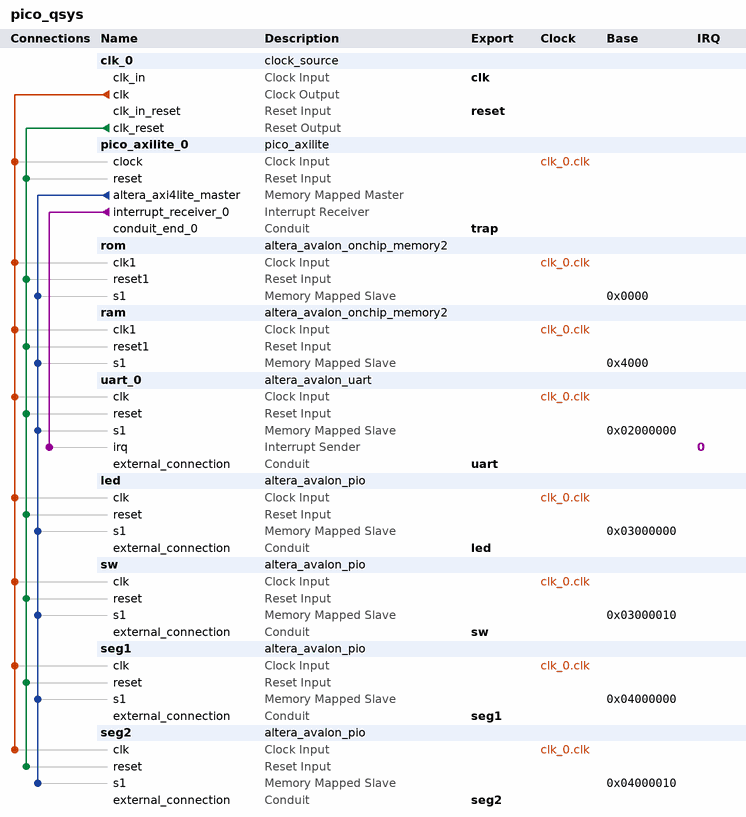
[diagram p0: system contents]
# Platform Designer (Qsys) system pico_qsys, MAX 10 10M08SAM153I7G
# Parameters at their usual value, and those the tool derives, are not listed.
package require -exact qsys 18.1
create_system pico_qsys
set_project_property DEVICE_FAMILY {MAX 10}
set_project_property DEVICE 10M08SAM153I7G

add_instance clk_0 clock_source 18.1
set_instance_parameter_value clk_0 clockFrequency 50000000

add_instance pico_axilite_0 pico_axilite 1.0
set_instance_parameter_value pico_axilite_0 BARREL_SHIFTER 0
set_instance_parameter_value pico_axilite_0 CATCH_ILLINSN 1
set_instance_parameter_value pico_axilite_0 CATCH_MISALIGN 1
set_instance_parameter_value pico_axilite_0 COMPRESSED_ISA 0
set_instance_parameter_value pico_axilite_0 ENABLE_COUNTERS 1
set_instance_parameter_value pico_axilite_0 ENABLE_COUNTERS64 1
set_instance_parameter_value pico_axilite_0 ENABLE_DIV 1
set_instance_parameter_value pico_axilite_0 ENABLE_FAST_MUL 0
set_instance_parameter_value pico_axilite_0 ENABLE_IRQ 1
set_instance_parameter_value pico_axilite_0 ENABLE_IRQ_QREGS 1
set_instance_parameter_value pico_axilite_0 ENABLE_IRQ_TIMER 1
set_instance_parameter_value pico_axilite_0 ENABLE_MUL 1
set_instance_parameter_value pico_axilite_0 ENABLE_PCPI 1
set_instance_parameter_value pico_axilite_0 ENABLE_REGS_16_31 1
set_instance_parameter_value pico_axilite_0 ENABLE_REGS_DUALPORT 1
set_instance_parameter_value pico_axilite_0 ENABLE_TRACE 0
set_instance_parameter_value pico_axilite_0 LATCHED_IRQ 4294967295
set_instance_parameter_value pico_axilite_0 MASKED_IRQ 0
set_instance_parameter_value pico_axilite_0 PROGADDR_IRQ 16
set_instance_parameter_value pico_axilite_0 PROGADDR_RESET 0
set_instance_parameter_value pico_axilite_0 REGS_INIT_ZERO 0
set_instance_parameter_value pico_axilite_0 STACKADDR 4294967295
set_instance_parameter_value pico_axilite_0 TWO_CYCLE_ALU 0
set_instance_parameter_value pico_axilite_0 TWO_CYCLE_COMPARE 0
set_instance_parameter_value pico_axilite_0 TWO_STAGE_SHIFT 1

add_instance rom altera_avalon_onchip_memory2 18.1
set_instance_parameter_value rom dataWidth 32
set_instance_parameter_value rom dualPort false
set_instance_parameter_value rom initMemContent true
set_instance_parameter_value rom initializationFileName C:/Users/91947/Desktop/final/soc_axilite/hx8kdemo_fw.hex
set_instance_parameter_value rom memorySize 16384
set_instance_parameter_value rom useNonDefaultInitFile true
set_instance_parameter_value rom writable false

add_instance ram altera_avalon_onchip_memory2 18.1
set_instance_parameter_value ram dataWidth 32
set_instance_parameter_value ram dualPort false
set_instance_parameter_value ram initMemContent true
set_instance_parameter_value ram initializationFileName onchip_mem.hex
set_instance_parameter_value ram memorySize 16384

add_instance uart_0 altera_avalon_uart 18.1
set_instance_parameter_value uart_0 baud 115200
set_instance_parameter_value uart_0 dataBits 8
set_instance_parameter_value uart_0 fixedBaud false
set_instance_parameter_value uart_0 parity NONE
set_instance_parameter_value uart_0 stopBits 1

add_instance led altera_avalon_pio 18.1
set_instance_parameter_value led direction Output
set_instance_parameter_value led resetValue 255
set_instance_parameter_value led width 8

add_instance sw altera_avalon_pio 18.1
set_instance_parameter_value sw direction Input
set_instance_parameter_value sw width 8

add_instance seg1 altera_avalon_pio 18.1
set_instance_parameter_value seg1 direction Output
set_instance_parameter_value seg1 resetValue 63
set_instance_parameter_value seg1 width 8

add_instance seg2 altera_avalon_pio 18.1
set_instance_parameter_value seg2 direction Output
set_instance_parameter_value seg2 resetValue 63
set_instance_parameter_value seg2 width 8

# connections
add_connection clk_0.clk led.clk clock
add_connection clk_0.clk pico_axilite_0.clock clock
add_connection clk_0.clk ram.clk1 clock
add_connection clk_0.clk rom.clk1 clock
add_connection clk_0.clk seg1.clk clock
add_connection clk_0.clk seg2.clk clock
add_connection clk_0.clk sw.clk clock
add_connection clk_0.clk uart_0.clk clock
add_connection clk_0.clk_reset led.reset reset
add_connection clk_0.clk_reset pico_axilite_0.reset reset
add_connection clk_0.clk_reset ram.reset1 reset
add_connection clk_0.clk_reset rom.reset1 reset
add_connection clk_0.clk_reset seg1.reset reset
add_connection clk_0.clk_reset seg2.reset reset
add_connection clk_0.clk_reset sw.reset reset
add_connection clk_0.clk_reset uart_0.reset reset
add_connection pico_axilite_0.altera_axi4lite_master led.s1 avalon
set_connection_parameter_value pico_axilite_0.altera_axi4lite_master/led.s1 baseAddress 0x03000000
add_connection pico_axilite_0.altera_axi4lite_master ram.s1 avalon
set_connection_parameter_value pico_axilite_0.altera_axi4lite_master/ram.s1 baseAddress 0x4000
add_connection pico_axilite_0.altera_axi4lite_master rom.s1 avalon
set_connection_parameter_value pico_axilite_0.altera_axi4lite_master/rom.s1 baseAddress 0x0000
add_connection pico_axilite_0.altera_axi4lite_master seg1.s1 avalon
set_connection_parameter_value pico_axilite_0.altera_axi4lite_master/seg1.s1 baseAddress 0x04000000
add_connection pico_axilite_0.altera_axi4lite_master seg2.s1 avalon
set_connection_parameter_value pico_axilite_0.altera_axi4lite_master/seg2.s1 baseAddress 0x04000010
add_connection pico_axilite_0.altera_axi4lite_master sw.s1 avalon
set_connection_parameter_value pico_axilite_0.altera_axi4lite_master/sw.s1 baseAddress 0x03000010
add_connection pico_axilite_0.altera_axi4lite_master uart_0.s1 avalon
set_connection_parameter_value pico_axilite_0.altera_axi4lite_master/uart_0.s1 baseAddress 0x02000000
add_connection pico_axilite_0.interrupt_receiver_0 uart_0.irq interrupt
set_connection_parameter_value pico_axilite_0.interrupt_receiver_0/uart_0.irq irqNumber 0

# exported interfaces
add_interface clk clock sink
set_interface_property clk EXPORT_OF clk_0.clk_in
add_interface led conduit end
set_interface_property led EXPORT_OF led.external_connection
add_interface reset reset sink
set_interface_property reset EXPORT_OF clk_0.clk_in_reset
add_interface seg1 conduit end
set_interface_property seg1 EXPORT_OF seg1.external_connection
add_interface seg2 conduit end
set_interface_property seg2 EXPORT_OF seg2.external_connection
add_interface sw conduit end
set_interface_property sw EXPORT_OF sw.external_connection
add_interface trap conduit end
set_interface_property trap EXPORT_OF pico_axilite_0.conduit_end_0
add_interface uart conduit end
set_interface_property uart EXPORT_OF uart_0.external_connection

set_interconnect_requirement {$system} qsys_mm.clockCrossingAdapter HANDSHAKE
set_interconnect_requirement {$system} qsys_mm.enableEccProtection FALSE
set_interconnect_requirement {$system} qsys_mm.insertDefaultSlave FALSE
set_interconnect_requirement {$system} qsys_mm.maxAdditionalLatency 1

save_system pico_qsys.qsys
